# EAGLE design Transceiver (EAGLE 6.4)
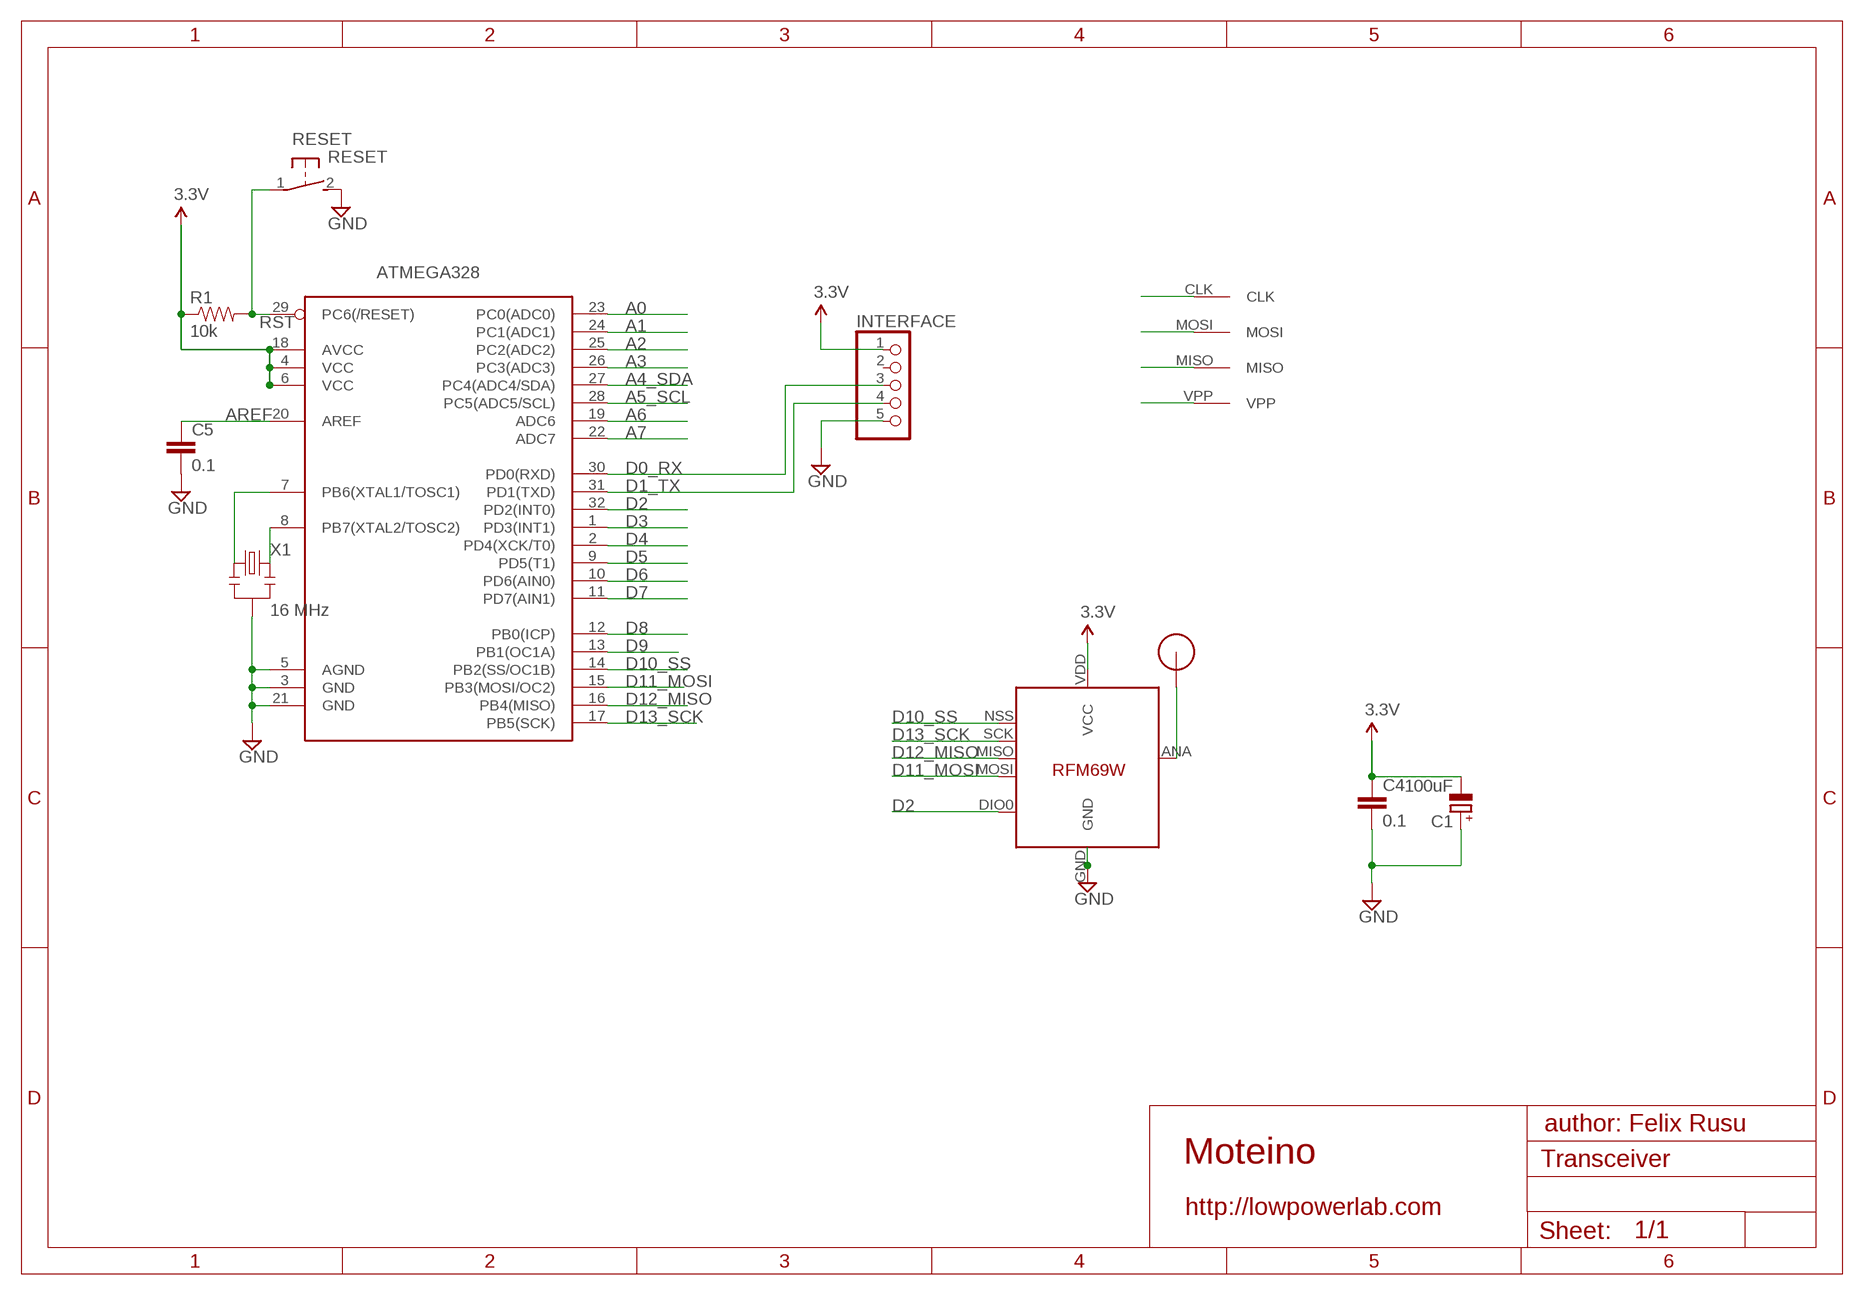
[diagram p0: schematic, sheet 1]

## Parts
ATMEGA328  ATMega-328  ATMEGA168/328TQFP32  [TQFP32-08]
C1  100uF  CPOL-EUSMCB  [SMC_B]
C4  0.1  CAP0603-CAP  [0603-CAP]
C5  0.1  CAP0603-CAP  [0603-CAP]
INTERFACE  PINHD-1X5/90  [1X05/90]
R1  10k  RESISTOR0603-RES  [0603-RES]
RESET  RESET  DTSM-3  [DTSM-3]
U$1  RFM12B_ANTENNA  [RFM12B-ANTENNA]
U$2  AVRHEADERDIP  [AVRHEADER]
U$5  RFM69  [RFM69W-MINPADS]
X1  16 MHz  RESONATORSMD  [RESONATOR-SMD]

## Nets
A0: ATMEGA328.23(PC0(ADC0))
A1: ATMEGA328.24(PC1(ADC1))
A2: ATMEGA328.25(PC2(ADC2))
A3: ATMEGA328.26(PC3(ADC3))
A4_SDA: ATMEGA328.27(PC4(ADC4/SDA))
A5_SCL: ATMEGA328.28(PC5(ADC5/SCL))
A6: ATMEGA328.19(ADC6)
A7: ATMEGA328.22(ADC7)
AREF: ATMEGA328.20(AREF) C5.1
D0_RX: ATMEGA328.30(PD0(RXD)) INTERFACE.3
D1_TX: ATMEGA328.31(PD1(TXD)) INTERFACE.4
D2: ATMEGA328.32(PD2(INT0)) U$5.DIO0
D3: ATMEGA328.1(PD3(INT1))
D4: ATMEGA328.2(PD4(XCK/T0))
D5: ATMEGA328.9(PD5(T1))
D6: ATMEGA328.10(PD6(AIN0))
D7: ATMEGA328.11(PD7(AIN1))
D8: ATMEGA328.12(PB0(ICP))
D9: ATMEGA328.13(PB1(OC1A))
D10_SS: ATMEGA328.14(PB2(SS/OC1B)) U$5.NSS(SEL)
D11_MOSI: ATMEGA328.15(PB3(MOSI/OC2)) U$2.MOSI U$5.MOSI
D12_MISO: ATMEGA328.16(PB4(MISO)) U$2.MISO U$5.MISO
D13_SCK: ATMEGA328.17(PB5(SCK)) U$2.CLK U$5.SCK
GND [power]: ATMEGA328.3(GND) ATMEGA328.5(AGND) ATMEGA328.21(GND) C1.+ C4.2 C5.2 INTERFACE.5 RESET.2 U$5.GND X1.2
N$1: ATMEGA328.7(PB6(XTAL1/TOSC1)) X1.1
N$3: U$1.P$1 U$5.ANA(ANT)
N$21: ATMEGA328.8(PB7(XTAL2/TOSC2)) X1.3
RST: ATMEGA328.29(PC6(/RESET)) R1.2 RESET.1 U$2.VPP
VCC: ATMEGA328.4(VCC) ATMEGA328.6(VCC) ATMEGA328.18(AVCC) C1.- C4.1 INTERFACE.1 R1.1 U$5.VDD(VCC) ; supply symbol labelled 3.3V
Unconnected: INTERFACE.2

## Notes on the sheet
- author: Felix Rusu
- Moteino
- http://lowpowerlab.com

## Library data of the parts
ATMEGA328 = LowPowerLab:ATMEGA168/328: Atmel 32-pin 8-bit micro, 16k flash.
C1 = resistor:CPOL-EU: POLARIZED CAPACITOR, European symbol
C4 C5 = LowPowerLab:CAP: Capacitor Standard 0603 ceramic capacitor, and 0.1" leaded capacitor.
INTERFACE = pinhead:PINHD-1X5: PIN HEADER
R1 = LowPowerLab:RESISTOR: Resistor Basic schematic elements and footprints for 0603, 1206, and PTH resistors.
RESET = switch-tact:DTSM-3
U$1 = LowPowerLab:RFM12B_ANTENNA
U$2 = RemoteHome:AVRHEADER
U$5 = LowPowerLab:RFM69
X1 = SparkFun:RESONATOR: Resonator Small SMD resonator. This is the itty bitty 10/20MHz resonators with built in caps. CSTCE10M0G55 and CSTCE20M0V53. Footprint has been reviewed closely but hasn't been tested yet.

## Net classes
1 power: width 0.381 mm, clearance 0.254 mm

## Board
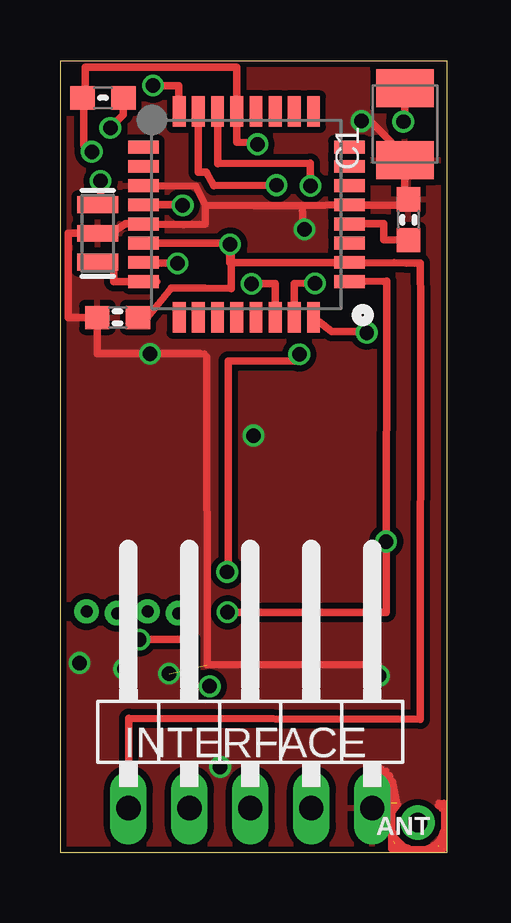
[diagram p1: board, top side]
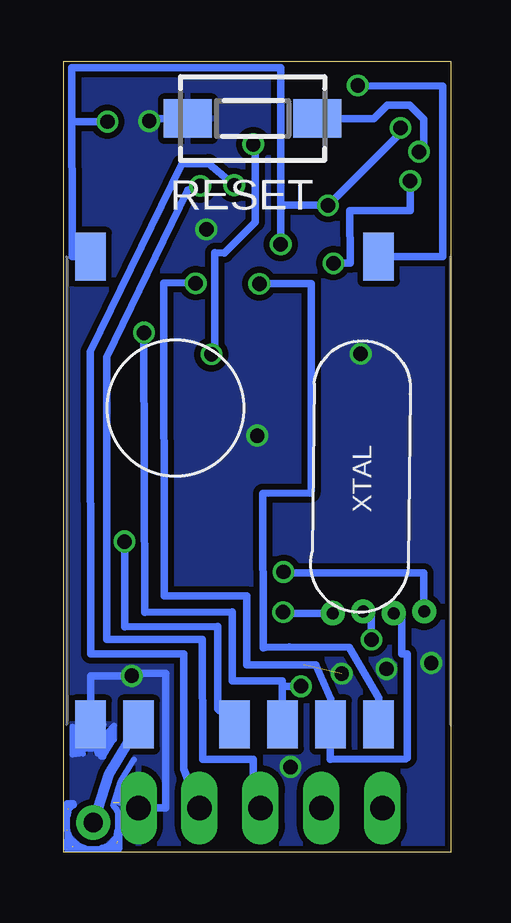
[diagram p2: board, bottom side, seen from below]

Size 16.13 x 32.98 mm. Coordinates in mm from the lower left corner, seen from the top.
Outline: 0,0 16.13,0 16.13,32.98 0,32.98 0,0
Copper layers (1*16): Top 0.035mm / dielectric 1.5mm / Bottom 0.035mm
Design rules "ITEADstudio_DRC": minimum track width 6mil, minimum drill 12mil, track to track 6mil, track to pad 6mil, pad to pad 6mil, via to via 6mil, smd to smd 0mil, copper to edge 10mil, drill to drill 10mil, minimum pad ring 10mil, minimum via ring 6mil, stop-mask expansion 2mil, vias tented up to drill 100mil, thermal gap 10mil

### Footprints (pad centres in the part's own frame; a part is rotated, then mirrored left to right if it is on the bottom)
TQFP32-08 = smd 1.27 x 0.533: 1 -4.293,2.8; 2 -4.293,2; 3 -4.293,1.2; 4 -4.293,0.4; 5 -4.293,-0.4; 6 -4.293,-1.2; 7 -4.293,-2; 8 -4.293,-2.8; 17 4.293,-2.8; 18 4.293,-2; 19 4.293,-1.2; 20 4.293,-0.4; 21 4.293,0.4; 22 4.293,1.2; 23 4.293,2; 24 4.293,2.8 | smd 0.533 x 1.27: 9 -2.8,-4.293; 10 -2,-4.293; 11 -1.2,-4.293; 12 -0.4,-4.293; 13 0.4,-4.293; 14 1.2,-4.293; 15 2,-4.293; 16 2.8,-4.293; 25 2.8,4.293; 26 2,4.293; 27 1.2,4.293; 28 0.4,4.293; 29 -0.4,4.293; 30 -1.2,4.293; 31 -2,4.293; 32 -2.8,4.293
SMC_B = smd 1.6 x 2.4: + -1.5,0; - 1.5,0
0603-CAP = smd 1.016 x 0.965: 1 -0.85,0; 2 0.85,0
1X05/90 = drill 1.016 long: 1 -5.08,-3.81; 2 -2.54,-3.81; 3 0,-3.81; 4 2.54,-3.81; 5 5.08,-3.81
0603-RES = smd 1.016 x 0.965: 1 -0.85,0; 2 0.85,0
DTSM-3 = smd 2 x 1.6: 1 -2.7,0; 2 2.7,0
RFM12B-ANTENNA = drill 0.8 pad 1.422: P$1 0,0
AVRHEADER = drill 0.5: CLK 2.54,0; MISO 1.27,0.07; MOSI 0,0; VPP -1.27,0.072
RFM69W-MINPADS = smd 2 x 1.27: ANA 8,-5; DIO0 -11.5,5; GND 8,-7; MISO 8,1; MOSI 8,3; NSS 8,5; SCK 8,-1; VDD -11.5,-7
RESONATOR-SMD = smd 0.7 x 1.7: 1 -1.2,0; 2 0,0; 3 1.2,0

### Placement (x,y rotation side)
ATMEGA328  7.76,26.59 0 top
C1  14.37,30.35 90 top
C4  2.4,22.3 180 top
C5  14.52,26.37 90 top
INTERFACE  7.93,5.66 0 top
R1  1.79,31.45 180 top
RESET  8.25,30.59 180 bottom
U$1  14.9,1.24 0 top
U$2  2.38,9.96 0 top
U$5  8,13.32 270 bottom
X1  1.57,25.8 270 top

### Tracks (layer width: path | path; a pad name or v marks a point on that pad's centre or on a via)
AREF
  Top 0.305: C5.1 13.49,25.54 13.49,26.21 12.63,26.21 ATMEGA328.20
D0_RX  (via drill 0.6)
  Top 0.305: ATMEGA328.30 6.56,28.7 10.44,28.72 v10.44,27.78
  Bottom 0.305: v10.44,27.78 10.96,27.6 14.34,20.65 14.32,8.87 10.36,8.87 10.34,3.88 8.23,3.88 8.22,1.86 INTERFACE.3
D1_TX  (via drill 0.6)
  Top 0.305: v9.02,27.81 6.41,27.8 6.09,28.35 5.76,28.36 ATMEGA328.31
  Bottom 0.305: INTERFACE.4 10.52,1.86 11.12,3.48 11.12,8.27 15.01,8.27 15.03,20.87 11.21,28.68 10.07,28.7 v9.02,27.81
D2  (via drill 0.6)
  Top 0.305: v3.88,31.96 4.96,31.96 ATMEGA328.32
  Bottom 0.305: v3.88,31.96 0.33,31.94 0.33,29.81 0.34,29.81 0.34,24.82 U$5.DIO0
D10_SS  (via drill 0.6)
  Top 0.305: v7.97,23.7 8.96,23.7 ATMEGA328.14
  Bottom 0.305: U$5.NSS 3,6.43 4.23,8.54 6.73,8.55 7.72,8.54 7.82,8.53 7.83,14.96 5.83,14.97 5.82,15.11 5.8,17.02 5.82,17.02 5.82,17.5 5.81,23.7 6.59,23.7 v7.97,23.7
D11_MOSI  (via drill 0.6)
  Top 0.305: v10.63,23.72 9.77,23.7 9.77,23.51 9.77,23.22 ATMEGA328.15
  Bottom 0.305: v10.63,23.72 10.91,23.74 11.95,23.73 11.94,10.69 8.49,10.69 8.49,7.81 5.62,7.81 5,6.4 U$5.MOSI 5.02,3.87 1.86,3.89 1.81,3.93 1.81,8.27 2.04,8.27 2.04,9.97 2.02,9.97 U$2.MOSI
D12_MISO  (via drill 0.6)
  Top 0.305: v12.78,21.66 12.74,21.71 11.32,21.71 ATMEGA328.16 | v3.3,8.87 5.45,8.87 5.45,6.92 v6.24,6.92
  Bottom 0.305: U$5.MISO 7.01,6.92 | 7.01,6.92 7.01,7.15 9.1,7.15 9.1,10.01 12.75,10 v12.78,21.66 | U$2.MISO 3.3,10.03 v3.3,8.87 | v6.24,6.92 6.98,6.92 7.01,6.92
D13_SCK  (via drill 0.6)
  Top 0.305: ATMEGA328.17 12.62,23.79 13.62,23.8 13.62,22.58 13.61,22.17 v13.59,12.95 13.59,10.01 v6.98,10.01
  Bottom 0.305: U$5.SCK 9.71,5.97 9.71,9.41 13.59,9.4 v13.59,12.95 | U$2.CLK 7.04,9.96 v6.98,10.01
GND  (via drill 0.6)  (7 unrouted)
  Top 0.254: 15.73,1.95 15.91,1.8 15.92,1.79 | 15.77,2.07 16,2.07 16,0.13 13.79,0.13 13.79,0.82 13.81,0.84 13.89,0.84 13.95,0.62 14.25,0.31 14.56,0.16 13.92,0.38 14.56,0.14 15.18,0.13 15.52,0.28 15.85,0.55 16,0.91 15.78,0.26 | 13.84,0.87 13.84,0.92 13.86,0.92 13.86,1.66 13.85,1.66 14.1,1.98 13.85,1.78 13.87,2.99 14.05,2.05 13.76,3.23 13.62,2.96 13.61,3.41 13.39,3.28 13.41,3.49 13.32,3.54 13.28,3.38
  Top 0.305: ATMEGA328.3 5.66,27.77 6.05,26.97 | 6.05,26.97 6.06,26.19 5.16,26.18 ATMEGA328.5 4.03,26.21 2.74,26.21 2.15,25.83 X1.2 0.33,25.8 0.33,22.3 C4.2 | 10.1,26.96 ATMEGA328.21 12.63,26.97 13.05,26.97 14.55,26.97 C5.2 14.38,27.34 C1.+ 13.79,29.44 13.79,29.62 12.93,30.48 v12.56,30.48 | 10.1,26.96 8.09,26.96 6.05,26.97 | C4.2 1.65,22.3 | v10.19,25.96 10.13,25.99 10.1,26.96 | v13.29,7.36 13.24,7.36 13.26,7.83 6.13,7.81 6.12,20.66 6,20.76 5.82,20.78 v3.75,20.78 1.55,20.78 C4.2
  Bottom 0.254: 15.98,1.56 16,1.53 16,0.93 15.84,0.56 15.52,0.29 15.15,0.14 14.62,0.14 14.27,0.3 13.9,0.68 13.92,0.72 13.89,0.85 | 13.89,0.85 13.86,0.97 13.86,1.64 13.92,1.79 14.06,1.94 13.74,2.96 13.2,3.86 | 13.73,2.56 13.8,2.06 | 13.82,0.91 13.84,0.91 13.89,0.85 | 15.99,0.96 16,0.13 15.02,0.13 | 13.89,0.47 14.03,0.3 | 15.99,0.5 15.73,0.25 15.73,0.23 | 15.71,2.05 16,2.05 16,1.57 | 14.57,3.98 14.56,3.99 14.48,3.99 14.04,4.7 14.04,5.28 14.29,4.99 14.29,4.55 14.72,4.11 14.76,4.3 15.73,4.3 15.32,4.12 15.75,4.06 15.75,5.23
  Bottom 0.305: 14.5,5.32 U$5.GND 15,7.36 v13.29,7.36 13.29,7.46 11.88,7.46 11.88,1.85 INTERFACE.5 | RESET.2 12.46,30.59 v12.56,30.48 | 15.73,1.98 15.94,1.81 15.98,1.56 | 13.82,0.91 13.82,0.16 14.52,0.16
  other vias: 8.06,17.37 4.54,7.44 0.81,7.89 2.68,7.64 6.67,3.56
  pour Bottom: 0.15,32.86 15.99,32.82 15.97,0.14 0.14,0.14 0.14,29.88
  pour Top: 15.97,32.86 15.99,29.89 15.99,0.14 0.16,0.14 0.15,32.88
N$1  (via drill 0.6)
  Top 0.305: X1.1 1.69,27 v1.69,27.99 | v4.89,24.56 4.03,24.56 ATMEGA328.7
  Bottom 0.305: v1.69,27.99 1.68,27.84 1.68,26.75 4.2,26.75 4.19,24.56 v4.89,24.56
N$3
  Bottom 0.406: U$5.ANA 14.24,3.26 U$1.P$1
N$21
  Top 0.305: X1.3 2.25,24.6 2.25,23.79 4.03,23.79 ATMEGA328.8
RST  (via drill 0.6)
  Top 0.305: v6.96,11.69 7,11.69 7,20.47 9.96,20.48 v9.97,20.76 | v8.23,29.52 8.2,29.54 8.28,29.59 7.37,29.6 ATMEGA328.29 7.36,32.73 1.05,32.73 1.05,31.87 R1.2 0.98,31.41 0.98,29.47 1.25,29.2 v1.32,29.2
  Bottom 0.305: U$2.VPP 1.14,10.04 1.14,11.65 6.96,11.65 v6.96,11.69 | v9.97,20.76 9.84,20.76 9.84,24.99 9.43,24.98 8.14,26.28 8.14,29.26 v8.23,29.52 | RESET.1 3.21,30.59 2.65,31.14 1.72,31.14 1.13,30.55 1.13,29.4 v1.32,29.2
VCC  (via drill 0.6)
  Top 0.305: v5.11,26.97 4.94,26.99 ATMEGA328.4 4.03,26.97 3.21,26.97 | ATMEGA328.6 6.96,25.39 | 6.96,25.39 7.12,25.39 7.12,23.5 6.03,23.52 4.64,23.52 3.65,22.32 C4.1 | 6.96,25.39 v7.09,25.34 7.08,24.59 ATMEGA328.18 12.61,24.56 13.93,24.57 14.44,24.56 15.01,24.56 15.02,22.73 15.02,6.61 15.01,5.55 2.85,5.57 INTERFACE.1 | R1.1 2.64,30.75 v2.1,30.2 | C1.- 14.38,30.48 v14.31,30.46
  Bottom 0.305: 7.09,26.97 v5.11,26.97 2.1,29.98 v2.1,30.2 | 7.09,26.97 7.09,32.72 15.79,32.72 15.79,30.46 | 15.79,30.46 15.78,26.6 15.78,24.82 U$5.VDD | v7.09,25.34 7.09,26.97 | v14.31,30.46 15,30.46 15.79,30.46

### Text on the board
_tsilk: ANT